# EAGLE design MainControllerBoardv2 (EAGLE 5.12)
MANUFACTURER: Vishay; MAN_PART_NO: 2N7002K-T1-E3; PRICE_1: 0.38000; PRICE_50: 0.17240; URL: http://www.digikey.com/product-detail/en/2N7002K-T1-E3/2N7002K-T1-E3CT-ND/1656760; VENDOR: Digikey
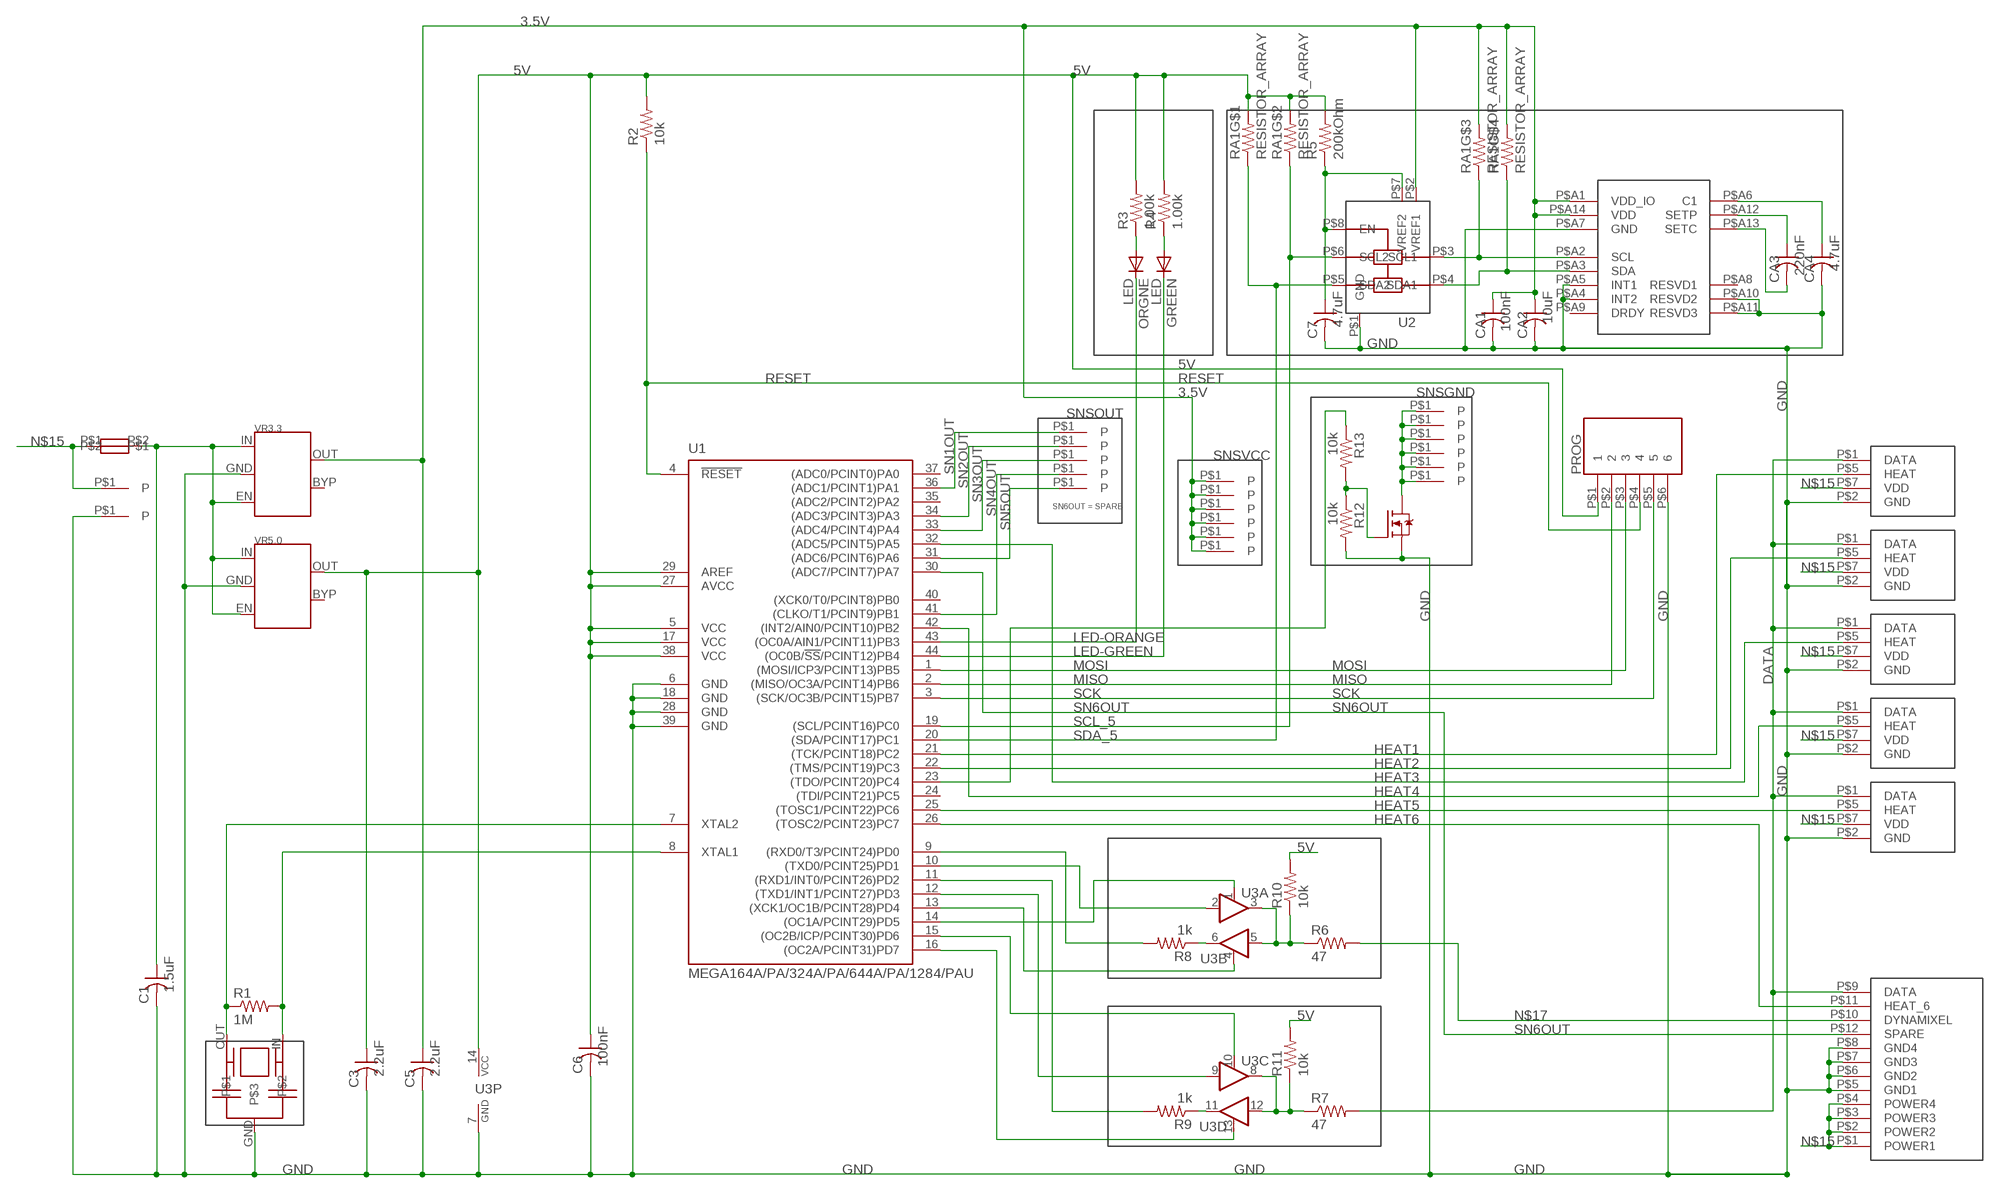
[diagram p0: schematic, sheet 1]

## Parts
BATGND  INDIVIDUAL_THROUG_HOLEDIA0.05  [INDIVIDUAL_THROUGH_HOLE_0.05]
BATVCC  INDIVIDUAL_THROUG_HOLEDIA0.05  [INDIVIDUAL_THROUGH_HOLE_0.05]
C1  1.5uF  CAPACITOR-1206  [C1206]
C3  2.2uF  CAPACITOR-1206  [C1206]
C5  2.2uF  CAPACITOR-1206  [C1206]
C6  100nF  CAPACITOR-0402  [C0402]
C7  4.7uF  CAPACITOR-0402  [C0402]
CA1  100nF  CAPACITOR-0402  [C0402]
CA2  10uF  CAPACITOR-0402  [C0402]
CA3  220nF  CAPACITOR-0402  [C0402]
CA4  4.7uF  CAPACITOR-0402  [C0402]
FFC1  FACE_BOARD_CONNECTOR  [FACE_BOARD_CONNECTOR]
FFC2  FACE_BOARD_CONNECTOR  [FACE_BOARD_CONNECTOR]
FFC3  FACE_BOARD_CONNECTOR  [FACE_BOARD_CONNECTOR]
FFC4  FACE_BOARD_CONNECTOR  [FACE_BOARD_CONNECTOR]
FFC5  FACE_BOARD_CONNECTOR  [FACE_BOARD_CONNECTOR]
FUSE  NANOFUSE  [NANOFUSE_BLOCK]
GREEN  LED  [LED0402]
ORGNE  LED  [LED0402]
PROG  CONNECTOR-FLEX(PROGRAMMING)-V2  [CONNECTOR-FLEX(PROGRAMMING)-V2]
R1  1M  RESISTOR-0402  [R0402]
R2  10k  RESISTOR-0402  [R0402]
R3  1.00k  RESISTOR-0402  [R0402]
R4  1.00k  RESISTOR-0402  [R0402]
R5  200kOhm  RESISTOR-0402  [R0402]
R6  47  RESISTOR-0402  [R0402]
R7  47  RESISTOR-0402  [R0402]
R8  1k  RESISTOR-0402  [R0402]
R9  1k  RESISTOR-0402  [R0402]
R10  10k  RESISTOR-0402  [R0402]
R11  10k  RESISTOR-0402  [R0402]
R12  10k  RESISTOR-0402  [R0402]
R13  10k  RESISTOR-0402  [R0402]
RA1  RESISTOR_ARRAY  [4XR0402]
RES  RESONATOR  [RESONATOR_CSTCE16M0V53-R0]
SENSFET  SINGLE-NFETSOT-23-3  [SOT-23-3]
SN1GND  INDIVIDUAL_THROUG_HOLEDIA0.02  [INDIVIDUAL_THROUGH_HOLE]
SN1OUT  INDIVIDUAL_THROUG_HOLEDIA0.02  [INDIVIDUAL_THROUGH_HOLE]
SN1VCC  INDIVIDUAL_THROUG_HOLEDIA0.02  [INDIVIDUAL_THROUGH_HOLE]
SN2OUT  INDIVIDUAL_THROUG_HOLEDIA0.02  [INDIVIDUAL_THROUGH_HOLE]
SN2VCC  INDIVIDUAL_THROUG_HOLEDIA0.02  [INDIVIDUAL_THROUGH_HOLE]
SN3GND  INDIVIDUAL_THROUG_HOLEDIA0.02  [INDIVIDUAL_THROUGH_HOLE]
SN3OUT  INDIVIDUAL_THROUG_HOLEDIA0.02  [INDIVIDUAL_THROUGH_HOLE]
SN3VCC  INDIVIDUAL_THROUG_HOLEDIA0.02  [INDIVIDUAL_THROUGH_HOLE]
SN4GND  INDIVIDUAL_THROUG_HOLEDIA0.02  [INDIVIDUAL_THROUGH_HOLE]
SN4OUT  INDIVIDUAL_THROUG_HOLEDIA0.02  [INDIVIDUAL_THROUGH_HOLE]
SN4VCC  INDIVIDUAL_THROUG_HOLEDIA0.02  [INDIVIDUAL_THROUGH_HOLE]
SN5GND  INDIVIDUAL_THROUG_HOLEDIA0.02  [INDIVIDUAL_THROUGH_HOLE]
SN5OUT  INDIVIDUAL_THROUG_HOLEDIA0.02  [INDIVIDUAL_THROUGH_HOLE]
SN5VCC  INDIVIDUAL_THROUG_HOLEDIA0.02  [INDIVIDUAL_THROUGH_HOLE]
SN6GND  INDIVIDUAL_THROUG_HOLEDIA0.02  [INDIVIDUAL_THROUGH_HOLE]
SN6VCC  INDIVIDUAL_THROUG_HOLEDIA0.02  [INDIVIDUAL_THROUGH_HOLE]
SNS2GND  INDIVIDUAL_THROUG_HOLEDIA0.02  [INDIVIDUAL_THROUGH_HOLE]
U1  MEGA164A/PA/324A/PA/644A/PA/1284/PAU  [TQFP44]
U2  I2C_VOLTAGE_LEVEL_TRANSLATOR  [8-VFSOP]
U3  74F126D  [SO14]
U4  ACC_MAG_LSM303DLHC  [LGA-14]
U$24  SLIPRING_CONNECTOR  [SLIPRING_CONNECTOR]
VR3.3  3.5V  POWER_REG3.3V-SOT-23-5  [SOT-23]
VR5.0  5.0V  POWER_REG5.0V-SOT-23-5  [SOT-23]

## Nets
3.5V: C5.POS CA1.POS CA2.POS RA1.P$5 RA1.P$6 SN1VCC.P$1(P) SN2VCC.P$1(P) SN3VCC.P$1(P) SN4VCC.P$1(P) SN5VCC.P$1(P) SN6VCC.P$1(P) U2.P$2(VREF1) U4.P$A1(VDD_IO) U4.P$A14(VDD) VR3.3.OUT
5V: C3.POS C6.POS PROG.P$1 R2.2 R3.2 R4.2 R5.2 R10.2 R11.2 RA1.P$7 RA1.P$8 U1.5(VCC) U1.17(VCC) U1.27(AVCC) U1.29(AREF) U1.38(VCC) U3.14(P:VCC) VR5.0.OUT
DATA: FFC1.P$1(DATA) FFC2.P$1(DATA) FFC3.P$1(DATA) FFC4.P$1(DATA) FFC5.P$1(DATA) R7.2 U$24.P$9(DATA)
GND: BATGND.P$1(P) C1.NEG C3.NEG C5.NEG C6.NEG C7.NEG CA1.NEG CA2.NEG CA4.NEG FFC1.P$2(GND) FFC2.P$2(GND) FFC3.P$2(GND) FFC4.P$2(GND) FFC5.P$2(GND) PROG.P$6 R12.2 RES.GND SENSFET.P$2(S) U1.6(GND) U1.18(GND) U1.28(GND) U1.39(GND) U2.P$1(GND) U3.7(P:GND) U4.P$A4(INT2) U4.P$A5(INT1) U4.P$A7(GND) U4.P$A10(RESVD2) U4.P$A11(RESVD3) U$24.P$5(GND1) U$24.P$6(GND2) U$24.P$7(GND3) U$24.P$8(GND4) VR3.3.GND VR5.0.GND
HEAT1: FFC1.P$5(HEAT) U1.21((TCK/PCINT18)PC2)
HEAT2: FFC2.P$5(HEAT) U1.22((TMS/PCINT19)PC3)
HEAT3: FFC3.P$5(HEAT) U1.32((ADC5/PCINT5)PA5)
HEAT4: FFC4.P$5(HEAT) U1.42((INT2/AIN0/PCINT10)PB2)
HEAT5: FFC5.P$5(HEAT) U1.25((TOSC1/PCINT22)PC6)
HEAT6: U1.26((TOSC2/PCINT23)PC7) U$24.P$11(HEAT_6)
LED-GREEN: GREEN.2(C) U1.44((OC0B/!SS!/PCINT12)PB4)
LED-ORANGE: ORGNE.2(C) U1.43((OC0A/AIN1/PCINT11)PB3)
MISO: PROG.P$2 U1.2((MISO/OC3A/PCINT14)PB6)
MOSI: PROG.P$3 U1.1((MOSI/ICP3/PCINT13)PB5)
N$2: U1.10((TXD0/PCINT25)PD1) U3.2(A:I)
N$4: U1.15((OC2B/ICP/PCINT30)PD6) U3.10(C:OE)
N$5: U1.16((OC2A/PCINT31)PD7) U3.13(D:OE)
N$7: U1.13((XCK1/OC1B/PCINT28)PD4) U3.4(B:OE)
N$8: R1.2 RES.IN U1.8(XTAL1)
N$9: R1.1 RES.OUT U1.7(XTAL2)
N$10: U1.14((OC1A/PCINT29)PD5) U3.1(A:OE)
N$12: ORGNE.1(A) R3.1
N$15: BATVCC.P$1(P) FFC1.P$7(VDD) FFC2.P$7(VDD) FFC3.P$7(VDD) FFC4.P$7(VDD) FFC5.P$7(VDD) FUSE.P$1 U$24.P$1(POWER1) U$24.P$2(POWER2) U$24.P$3(POWER3) U$24.P$4(POWER4)
N$17: R6.2 U$24.P$10(DYNAMIXEL)
N$18: R9.1 U3.11(D:O)
N$19: R7.1 R11.1 U3.8(C:O) U3.12(D:I)
N$20: R8.1 U3.6(B:O)
N$21: R6.1 R10.1 U3.3(A:O) U3.5(B:I)
N$22: R8.2 U1.9((RXD0/T3/PCINT24)PD0)
N$24: CA4.POS U4.P$A6(C1)
N$25: CA3.POS U4.P$A12(SETP)
N$26: CA3.NEG U4.P$A13(SETC)
N$29: C7.POS R5.1 U2.P$7(VREF2) U2.P$8(EN)
N$32: R12.1 R13.2 SENSFET.P$1(G)
N$33: R13.1 U1.23((TDO/PCINT20)PC4)
N$38: C1.POS FUSE.P$2 VR3.3.EN VR3.3.IN VR5.0.EN VR5.0.IN
R4: GREEN.1(A) R4.1
RESET: PROG.P$4 R2.1 U1.4(!RESET)
RXD0: R9.2 U1.11((RXD1/INT0/PCINT26)PD2)
SCK: PROG.P$5 U1.3((SCK/OC3B/PCINT15)PB7)
SCL_5: RA1.P$2 U1.19((SCL/PCINT16)PC0) U2.P$6(SCL2)
SCL_35: RA1.P$3 U2.P$3(SCL1) U4.P$A2(SCL)
SDA_5: RA1.P$1 U1.20((SDA/PCINT17)PC1) U2.P$5(SDA2)
SDA_35: RA1.P$4 U2.P$4(SDA1) U4.P$A3(SDA)
SN1OUT: SN1OUT.P$1(P) U1.36((ADC1/PCINT1)PA1)
SN2OUT: SN2OUT.P$1(P) U1.34((ADC3/PCINT3)PA3)
SN3OUT: SN3OUT.P$1(P) U1.33((ADC4/PCINT4)PA4)
SN4OUT: SN4OUT.P$1(P) U1.41((CLKO/T1/PCINT9)PB1)
SN5OUT: SN5OUT.P$1(P) U1.31((ADC6/PCINT6)PA6)
SN6OUT: U1.30((ADC7/PCINT7)PA7) U$24.P$12(SPARE)
SNSGND: SENSFET.P$3(D) SN1GND.P$1(P) SN3GND.P$1(P) SN4GND.P$1(P) SN5GND.P$1(P) SN6GND.P$1(P) SNS2GND.P$1(P)
TXD0: U1.12((TXD1/INT1/PCINT27)PD3) U3.9(C:I)
Unconnected: U1.24((TDI/PCINT21)PC5) U1.35((ADC2/PCINT2)PA2) U1.37((ADC0/PCINT0)PA0) U1.40((XCK0/T0/PCINT8)PB0) U4.P$A8(RESVD1) U4.P$A9(DRDY) VR3.3.BYP VR5.0.BYP

## Notes on the sheet
- SNSGND
- SNSOUT
- SNSVCC
- SN6OUT = SPARE

## Library data of the parts
BATGND BATVCC SN1GND SN1OUT SN1VCC SN2OUT SN2VCC SN3GND SN3OUT SN3VCC SN4GND SN4OUT SN4VCC SN5GND SN5OUT SN5VCC SN6GND SN6VCC SNS2GND = Connectors:INDIVIDUAL_THROUG_HOLE
C1 C3 C5-C7 CA1-CA4 = Passives:CAPACITOR: Capacitor
FFC1-FFC5 = Connectors:FACE_BOARD_CONNECTOR; MANUFACTURER: TE Connectivity; MAN_PART_NO: 1-84981-0; PRICE_1: 0.19000; PRICE_50: 0.13240; URL: http://search.digikey.com/us/en/products/1-84981-0/A100308CT-ND/2180637; VENDOR: Digikey
FUSE = Passives:NANOFUSE: Holder for 500mA Littlefuse fuse.; MANUFACTURER: Littlefuse; MAN_PART_NO: 0157.500DR; PRICE_1: 3.18000; PRICE_50: 2.92200; URL: http://search.digikey.com/us/en/products/0157.500DR/F2960CT-ND/1972009; VENDOR: Digikey
GREEN ORGNE = Passives:LED: Small inidicator LED
PROG = Connectors:CONNECTOR-FLEX(PROGRAMMING)-V2; MANUFACTURER: FCI; MAN_PART_NO: HFW6R-2STE1LF; PRICE_1: 0.59000; PRICE_50: 0.36900; URL: http://search.digikey.com/us/en/products/HFW6R-2STE1LF/609-1787-1-ND/1003008; VENDOR: Digikey
R1-R13 = Passives:RESISTOR: Resistor
RA1 = Passives:RESISTOR_ARRAY
RES = Passives:RESONATOR; MANUFACTURER: Murata; MAN_PART_NO: CSTCE16M0V53-R0; PRICE_1: 0.69000; PRICE_50: 0.49600; URL: http://search.digikey.com/us/en/products/CSTCE16M0V53-R0/490-1198-1-ND/584635; VENDOR: Digikey
SENSFET = Transistors:SINGLE-NFET
U1 = Devices:MEGA164A/PA/324A/PA/644A/PA/1284/P*AU: TQFP44 package of Atmega1284; MANUFACTURER: Atmel; MAN_PART_NO: ATMEGA1284-AUR; PRICE_1: 7.44000; PRICE_50: 6.22800; URL: http://search.digikey.com/us/en/products/ATMEGA1284-AUR/ATMEGA1284-AURCT-ND/2477102; VENDOR: Digikey
U2 = Devices:I2C_VOLTAGE_LEVEL_TRANSLATOR; MANUFACTURER: TI; MAN_PART_NO: PCA9306DCUR; PRICE_1: 0.94000; PRICE_50: 0.74880; URL: http://search.digikey.com/us/en/products/PCA9306DCUR/296-17988-1-ND/768360; VENDOR: Digikey
U3 = Devices:74*126: Quad bus BUFFER, 3-state; MANUFACTURER: NXP; MAN_PART_NO: N74F126D; PRICE_1: 0.46000; PRICE_50: 0.34120; URL: http://search.digikey.com/us/en/products/N74F126D,623/568-4637-1-ND/1965426; VENDOR: Digikey
U4 = Devices:ACC_MAG_LSM303DLHC: 3-axis acc/mag; MANUFACTURER: STMicroelectronics; MAN_PART_NO: LSM303DLHC; PRICE_1: 8.20000; PRICE_50: 6.71000; URL: http://search.digikey.com/us/en/products/LSM303DLHCTR/497-11918-1-ND/2757636; VENDOR: Digikey
U$24 = Connectors:SLIPRING_CONNECTOR
VR3.3 = Devices:POWER_REG: Linear Power Regulator; MANUFACTURER: Linear Technology; MAN_PART_NO: LT1761ES5-3.3; PRICE_1: 2.39000; PRICE_50: 2.13560; URL: http://search.digikey.com/us/en/products/LT1761ES5-3.3%23TRMPBF/LT1761ES5-3.3%23TRMPBFCT-ND/894314; VENDOR: Digikey
VR5.0 = Devices:POWER_REG: Linear Power Regulator; MANUFACTURER: Micrel; MAN_PART_NO: MIC5219-5.0YM5 TR; PRICE_1: 1.43000; PRICE_50: 1.14000; URL: http://search.digikey.com/us/en/products/MIC5219-5.0YM5%20TR/576-2770-1-ND/1821930; VENDOR: Digikey

## Board
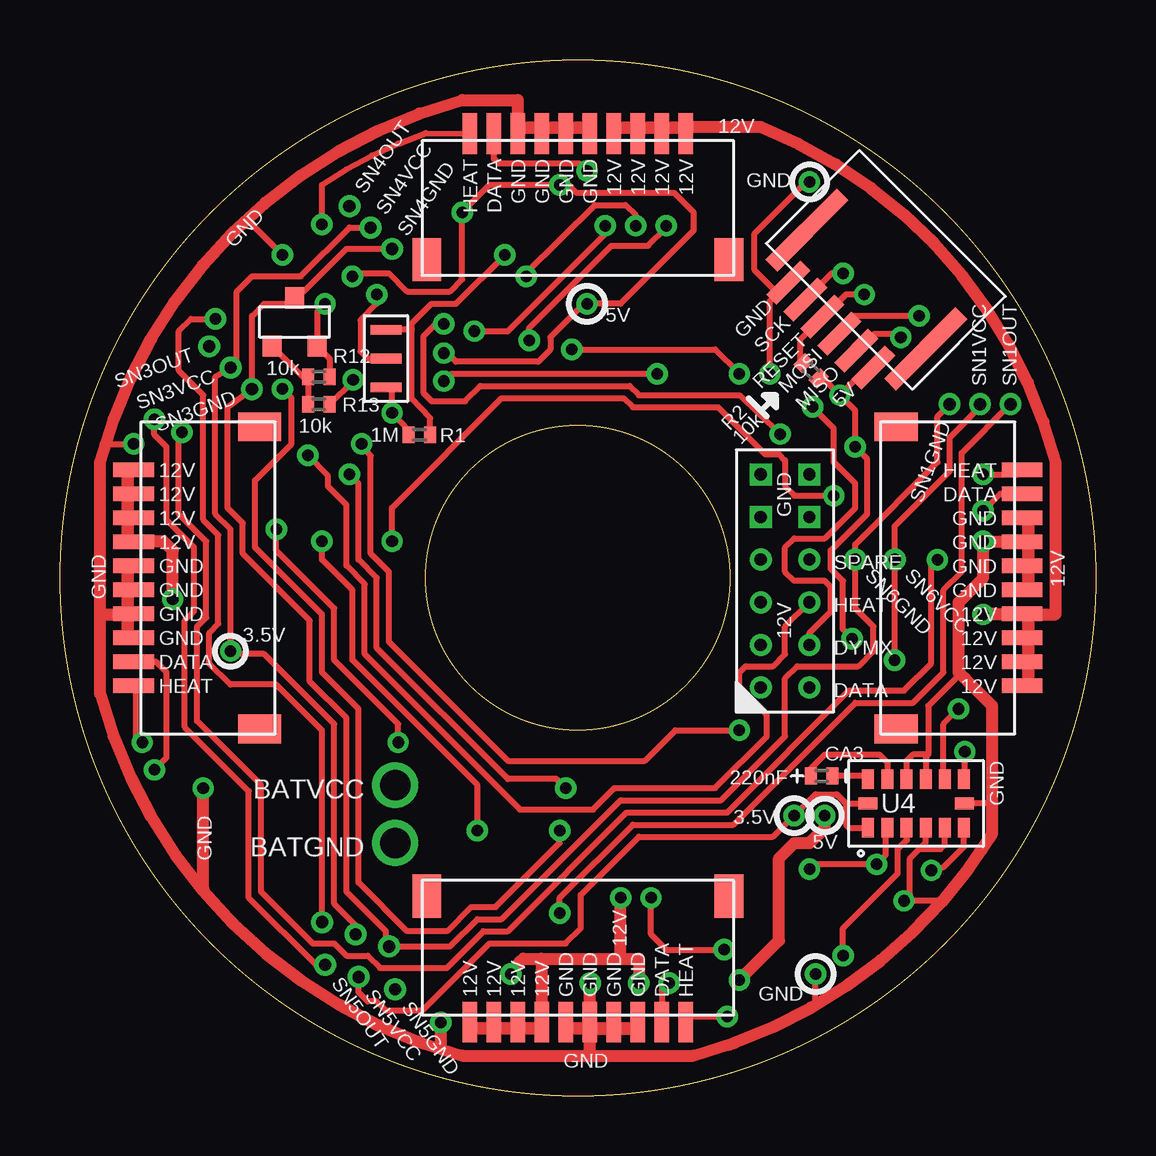
[diagram p1: board, top side]
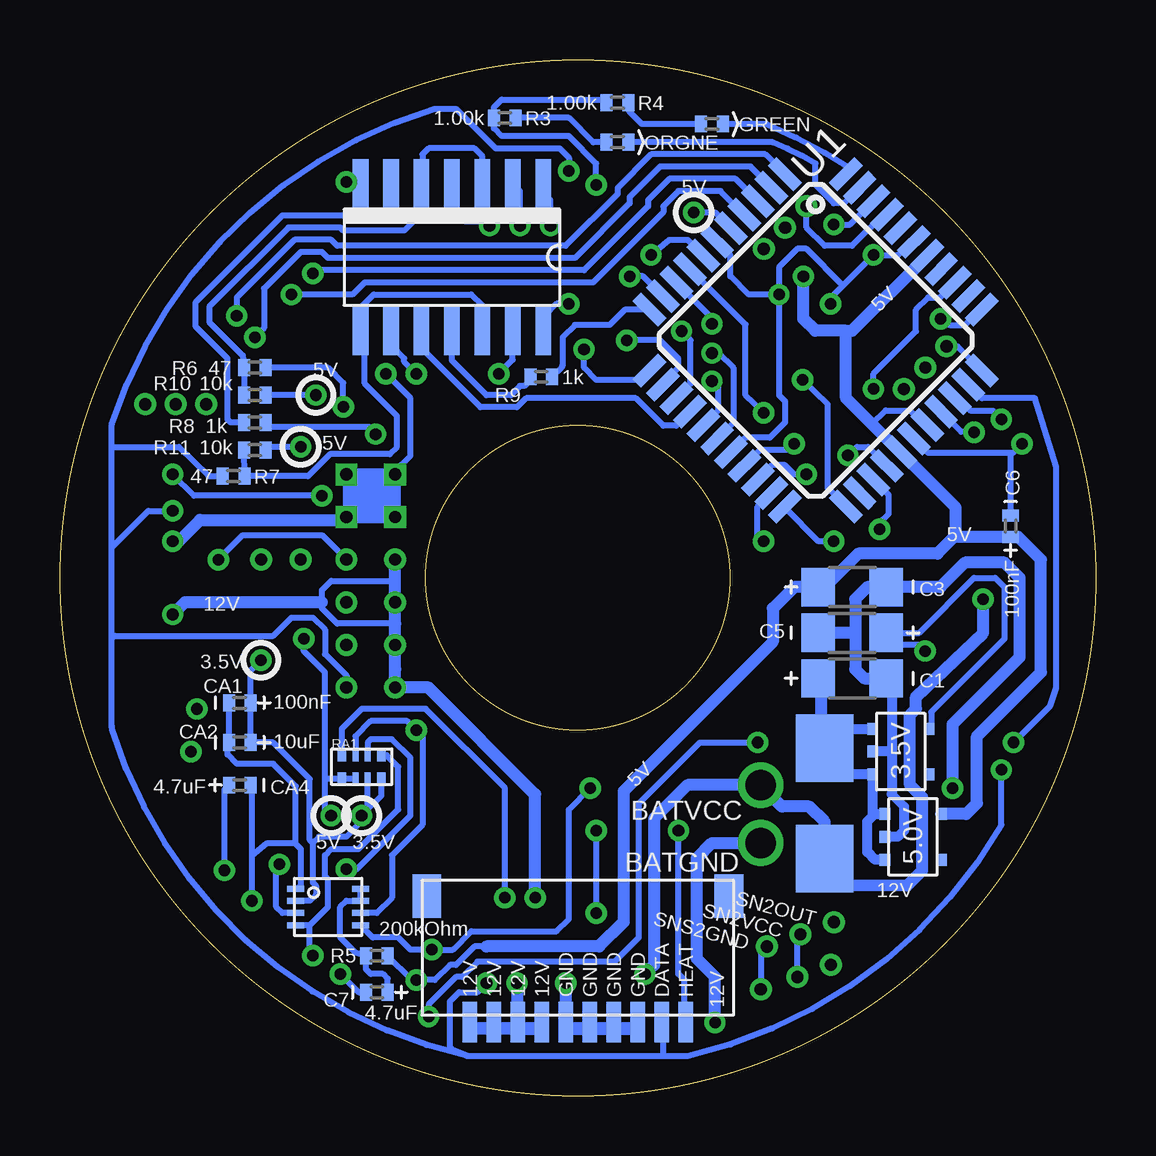
[diagram p2: board, bottom side, seen from below]

Size 43.18 x 43.18 mm. Coordinates in mm from the lower left corner, seen from the top.
Outline: circle at 21.59,21.59 radius 6.35
Outline: circle at 21.59,21.59 radius 21.59
Copper layers (1*16): Top 0.0178mm / dielectric 1.4986mm / Bottom 0.0178mm
Design rules "SSC-EAGLE-2Lyr_v1.0.0.3 *": minimum track width 10mil, minimum drill 19mil, track to track 10mil, track to pad 10mil, pad to pad 10mil, via to via 10mil, smd to smd 10mil, copper to edge 20mil, drill to drill 16mil, minimum pad ring 8mil, minimum via ring 8mil, stop-mask expansion 3mil, vias tented up to drill 0mil, thermal gap 10mil
tRestrict: area 14.2,14.2 to 29,29; area 1,1 to 42.2,42.2
bRestrict: area 1,1 to 42.2,42.2; area 14.2,14.2 to 29,29

### Footprints (pad centres in the part's own frame; a part is rotated, then mirrored left to right if it is on the bottom)
INDIVIDUAL_THROUGH_HOLE_0.05 = drill 1.27 round: P$1 0,0
C1206 = smd 1.4 x 1.6: NEG -1.422,0; POS 1.422,0
C0402 = smd 0.5 x 0.7: NEG -0.45,0; POS 0.45,0
FACE_BOARD_CONNECTOR = smd 0.6 x 1.7: P$1 -3.5,0; P$2 -2.5,0; P$3 -1.5,0; P$4 -0.5,0; P$5 -4.5,0; P$6 0.5,0; P$7 1.5,0; P$8 2.5,0; P$9 3.5,0; P$12 4.5,0 | smd 1.2 x 1.8: P$10 -6.3,-5.25; P$11 6.3,-5.25
NANOFUSE_BLOCK = smd 2.8 x 2.4: P$1 -2.3,0; P$2 2.3,0
LED0402 = smd 0.5 x 0.7: 1 -0.45,0; 2 0.45,0
CONNECTOR-FLEX(PROGRAMMING)-V2 = smd 0.6 x 2: P$1 -2.5,0; P$2 -1.5,0; P$3 -0.5,0; P$4 0.5,0; P$5 1.5,0; P$6 2.5,0 | smd 0.7 x 4.2: P$7 -3.5,-2.1; P$8 3.5,-2.1
R0402 = smd 0.5 x 0.7: 1 -0.45,0; 2 0.45,0
4XR0402 = smd 0.368 x 0.5: P$1 -0.826,0.475; P$4 0.826,0.475; P$5 0.826,-0.475; P$8 -0.826,-0.475 | smd 0.254 x 0.5: P$2 -0.254,0.475; P$3 0.254,0.475; P$6 0.254,-0.475; P$7 -0.254,-0.475
RESONATOR_CSTCE16M0V53-R0 = smd 0.4 x 1.3: GND 0,0; IN -1.2,0; OUT 1.2,0
SOT-23-3 = smd 0.787 x 0.889: P$1 0.94,1.003; P$2 -0.94,1.003; P$3 0,-1.003
INDIVIDUAL_THROUGH_HOLE = drill 0.508 round: P$1 0,0
TQFP44 = smd 1.5 x 0.5: 1 -5.8,4; 2 -5.8,3.2; 3 -5.8,2.4; 4 -5.8,1.6; 5 -5.8,0.8; 6 -5.8,0; 7 -5.8,-0.8; 8 -5.8,-1.6; 9 -5.8,-2.4; 10 -5.8,-3.2; 11 -5.8,-4; 23 5.8,-4; 24 5.8,-3.2; 25 5.8,-2.4; 26 5.8,-1.6; 27 5.8,-0.8; 28 5.8,0; 29 5.8,0.8; 30 5.8,1.6; 31 5.8,2.4; 32 5.8,3.2; 33 5.8,4 | smd 0.5 x 1.5: 12 -4,-5.8; 13 -3.2,-5.8; 14 -2.4,-5.8; 15 -1.6,-5.8; 16 -0.8,-5.8; 17 0,-5.8; 18 0.8,-5.8; 19 1.6,-5.8; 20 2.4,-5.8; 21 3.2,-5.8; 22 4,-5.8; 34 4,5.8; 35 3.2,5.8; 36 2.4,5.8; 37 1.6,5.8; 38 0.8,5.8; 39 0,5.8; 40 -0.8,5.8; 41 -1.6,5.8; 42 -2.4,5.8; 43 -3.2,5.8; 44 -4,5.8
8-VFSOP = smd 0.254 x 0.7: P$1 -0.762,-1.35; P$2 -0.254,-1.35; P$3 0.254,-1.35; P$4 0.762,-1.35; P$5 0.762,1.35; P$6 0.254,1.35; P$7 -0.254,1.35; P$8 -0.762,1.35
SO14 = smd 0.66 x 2.032: 1 -3.81,-3.073; 2 -2.54,-3.073; 3 -1.27,-3.073; 4 0,-3.073; 5 1.27,-3.073; 6 2.54,-3.073; 7 3.81,-3.073; 8 3.81,3.073; 9 2.54,3.073; 10 1.27,3.073; 11 0,3.073; 12 -1.27,3.073; 13 -2.54,3.073; 14 -3.81,3.073
LGA-14 = smd 0.5 x 0.8: P$A1 -2,-1.012; P$A2 -1.2,-1.012; P$A3 -0.4,-1.012; P$A4 0.4,-1.012; P$A5 1.2,-1.012; P$A6 2,-1.012; P$A8 2,1.012; P$A9 1.2,1.012; P$A10 0.4,1.012; P$A11 -0.4,1.012; P$A12 -1.2,1.012; P$A13 -2,1.012 | smd 0.8 x 0.5: P$A7 2.013,0; P$A14 -2.013,0
SLIPRING_CONNECTOR = drill 0.508 round: P$1 -4.572,1.016; P$2 -2.794,1.016; P$3 -1.016,1.016; P$4 0.762,1.016; P$9 -4.572,-1.016; P$10 -2.794,-1.016; P$11 -1.016,-1.016; P$12 0.762,-1.016 | drill 0.508 square: P$5 2.54,1.016; P$6 4.318,1.016; P$7 2.54,-1.016; P$8 4.318,-1.016
SOT-23 = smd 0.5 x 0.45: BYP -0.95,-1.175; EN -0.95,1.175; GND 0,1.175; IN 0.95,1.175; OUT 0.95,-1.175

### Placement (x,y rotation side)
BATGND  13.97,10.54 180 top
BATVCC  13.97,12.95 180 top
C1  10.16,17.4 180 bottom
C3  10.16,21.21 180 bottom
C5  10.16,19.3 0 bottom
C6  3.56,23.75 270 bottom
C7  29.97,4.32 0 bottom
CA1  35.69,16.38 0 bottom
CA2  35.69,14.73 0 bottom
CA3  31.75,13.34 180 top
CA4  35.69,12.95 180 bottom
FFC1  40.11,21.59 270 top
FFC2  21.59,3.07 180 bottom
FFC3  3.07,21.59 90 top
FFC4  21.59,40.11 0 top
FFC5  21.59,3.07 180 top
FUSE  11.3,12.19 90 bottom
GREEN  16,40.51 0 bottom
ORGNE  19.94,39.75 0 bottom
PROG  32.13,32.13 135 top
R1  14.99,27.56 180 top
R2  31.31,30.23 315 top
R3  24.64,40.77 180 bottom
R4  19.94,41.4 180 bottom
R5  29.97,5.84 0 bottom
R6  35.05,30.35 0 bottom
R7  35.94,25.83 180 bottom
R8  35.05,28.07 0 bottom
R9  23.11,29.97 0 bottom
R10  35.05,29.21 0 bottom
R11  35.05,26.92 0 bottom
R12  10.8,29.97 0 top
R13  10.8,28.83 180 top
RA1  30.61,13.72 0 bottom
RES  13.59,30.73 90 top
SENSFET  9.78,32.26 180 top
SN1GND  37.08,28.83 250 top
SN1OUT  39.62,28.83 90 top
SN1VCC  38.35,28.83 90 top
SN2OUT  10.92,7.24 165 bottom
SN2VCC  12.32,6.73 165 bottom
SN3GND  8,29.46 200 top
SN3OUT  6.22,31.24 200 top
SN3VCC  7.11,30.35 200 top
SN4GND  13.84,35.31 55 top
SN4OUT  12.07,37.08 55 top
SN4VCC  12.95,36.2 55 top
SN5GND  13.97,4.45 305 top
SN5OUT  11.05,5.46 305 top
SN5VCC  12.45,4.95 305 top
SN6GND  33.15,22.35 315 top
SN6VCC  34.8,22.35 315 top
SNS2GND  13.72,6.22 165 bottom
U1  11.68,31.5 315 bottom
U2  32,7.87 270 bottom
U3  26.85,34.96 180 bottom
U4  35.69,12.19 0 top
U$24  30.23,21.59 90 top
VR3.3  8.13,14.35 90 bottom
VR5.0  7.62,10.8 90 bottom

### Tracks (layer width: path | path; a pad name or v marks a point on that pad's centre or on a via)
3.5V  (via drill 0.48)
  Top 0.254: SN1VCC.P$1 38.35,28.7 37.08,27.43 37.08,26.04 34.8,23.75 SN6VCC.P$1 v34.8,18.16 | 32.77,12.19 U4.P$A14 | U4.P$A1 32.89,11.18 32.77,11.3 32.77,12.19 | 32.77,12.19 32.39,12.57 31.5,12.57 v30.61,11.68 29.72,10.8 24.13,10.8 21.72,8.38 21.72,6.99 21.08,6.35 17.91,6.35 15.11,3.56 13.59,3.56 13.21,3.94 12.83,3.94 12.45,4.32 SN5VCC.P$1 | SN4VCC.P$1 12.07,36.2 10.03,34.16 8,34.16 7.37,33.53 7.37,30.61 SN3VCC.P$1 6.48,29.97 6.48,24.26 7.11,23.62 v7.11,18.54 6.99,18.42 8.51,18.42 11.43,15.49 11.43,8 12.32,7.11 SN2VCC.P$1
  Bottom 0.254: SN5VCC.P$1 12.45,6.6 SN2VCC.P$1 | U2.P$2 32.77,8.13 32.51,8.38 32.51,8.76 32.64,8.89 32.64,10.54 | RA1.P$5 29.78,12.51 30.35,11.94 | 30.35,11.94 RA1.P$6 | 30.35,11.94 v30.61,11.68 30.61,11.43 31.24,10.8 32.39,10.8 32.64,10.54 | 32.64,10.54 32.77,10.67 32.77,13.21 34.29,14.73 CA2.POS CA1.POS 35.24,17.72 v34.8,18.16 | v7.11,18.54 7.37,18.8 8.1,18.8 C5.POS 7.37,19.3 5.08,21.59 4.19,21.59 3.81,21.21 3.81,19.05 6.86,16 6.86,15.4 VR3.3.OUT
5V  (via drill 0.48)
  Top 0.254: 34.13,30.47 34.03,30.47 PROG.P$1 33.67,30.36 v32.51,29.21 | R2.2 31.81,29.91 v32.51,29.21 | v32.51,29.21 33.15,28.57 v33.15,27.05 33.66,26.54 33.66,24.26 32.13,22.73 32.13,21.97 32.64,21.46 32.64,19.43 v33.02,19.05 | v12.19,34.16 12.32,34.29 13.72,34.29 14.48,33.53 16.26,33.53 16.76,34.04 v16.76,36.83 17.91,37.97 v20.83,37.97 21.21,37.97 21.54,37.64 25.6,37.64 26.42,36.83 26.42,36.07 23.37,33.02 v21.97,33.02 21.84,33.02 20.45,31.62 20.45,31.11 19.94,30.61 16.51,30.61 16.15,30.96 v16,30.96
  Top 0.508: v31.88,11.68 31.88,11.18 31.24,10.54 30.61,10.54 29.97,9.91 29.97,6.48 v28.32,4.83
  Bottom 0.254: U1.27 8.12,26.8 | 15.34,36.16 U1.5 15.89,36.83 v16.76,36.83 | U3.14 22.9,32.26 22.9,31.03 23.11,31.11 22.99,32.51 22.48,33.02 v21.97,33.02 | U1.29 7.09,27.96 7.11,27.94 7.76,28.57 8.76,28.57 9.34,28 | RA1.P$7 RA1.P$8 32.1,13.24 32.13,13.21 | R4.2 20.45,41.53 24.77,41.53 25.09,41.21 R3.2 25.09,40.33 24.77,40 21.97,40 20.83,38.86 v20.83,37.97 | U1.17 15.11,28.07 15.11,30.35 15.72,30.96 v16,30.96 | v32.51,29.21 R10.2 | v33.15,27.05 34.47,27.05 R11.2 | v33.02,19.05 33.02,18.54 32.13,17.65 32.13,13.21 | R5.2 28.51,4.83 v28.32,4.83 27.56,4.83 26.92,5.46 26.67,5.46 25.91,6.22 25.4,6.22 | 32.13,13.21 32.13,11.94 v31.88,11.68
  Bottom 0.508: VR5.0.OUT 5.4,11.75 4.95,12.19 4.95,14.99 2.29,17.65 2.29,22.35 3.23,23.3 C6.POS 5.84,23.3 | 5.84,23.3 5.91,23.3 6.6,22.61 9.91,22.61 11.3,21.21 C3.POS 12.57,21.21 13.46,20.32 13.46,18.92 19.69,12.7 19.69,7.24 20.7,6.22 25.4,6.22 | 8.12,26.8 5.84,24.52 5.84,23.3 | U1.27 9.34,28 10.41,29.08 10.41,31.89 | U1.38 10.16,31.89 10.41,31.89 | 10.41,31.89 11.7,31.89 12.19,32.39 v12.19,34.16
DATA  (via drill 0.48)
  Top 0.254: FFC3.P$1 4.01,18.09 4.45,17.65 4.45,14.1 v3.94,13.59 | FFC4.P$1 18.09,39.06 18.29,38.86 21.64,38.86 v21.97,38.56 | v38.48,24.38 39.19,25.09 FFC1.P$1 | FFC5.P$1 25.09,4.39 v25.4,4.7
  Bottom 0.254: v3.94,13.59 3.94,11.3 arc47 17.02,1.65 18.03,1.65 | FFC2.P$1 18.03,3.1 18.03,1.65 | 41.02,22.86 39.5,24.38 v38.48,24.38 | 18.03,1.65 26.14,1.65 26.21,1.67 | 26.21,1.67 arc60 41.01,15.28 41.02,15.42 41.02,19.05 | 41.02,22.86 41.02,27.05 | 41.02,27.05 41.02,27.99 arc55 27.56,41.15 26.67,41.15 25.02,39.5 22.35,39.5 21.97,39.12 v21.97,38.56 | R7.2 36.98,25.83 38.23,27.05 41.02,27.05 | 41.02,19.05 41.02,22.86 | U$24.P$9 31.24,17.53 32.13,18.42 32.13,19.43 32.64,19.94 33.53,19.94 34.29,19.18 40.89,19.18 arc-90 41.02,19.05 | 26.21,1.67 26.8,1.91 26.92,2.03 26.92,3.94 26.54,4.32 25.78,4.32 v25.4,4.7
GND  (via drill 0.48)
  Top 0.254: FFC3.P$2 2.79,19.34 2.79,20.07 | 5.97,8.64 arc-22 1.68,16.76 | 21.84,40.39 22.1,40.13 | 36.09,14.12 U4.P$A10 | v31.5,5.08 31.5,3.81 30.86,3.43 29.46,2.67 27.94,2.03 26.42,1.68 | U4.P$A4 36.09,10.56 35.81,10.29 | U4.P$A5 36.89,10.47 36.7,10.29 35.81,10.29 | 35.81,10.29 35.43,9.91 35.43,8.38 v35.18,8.13 36.83,8.13 | 36.83,8.13 arc-12 37.72,9.14 | U4.P$A11 35.29,13.95 35.56,14.22 36.11,14.22 36.09,14.12 | 9.14,5.59 11.81,3.68 14.25,2.46 | 14.25,2.46 14.61,2.29 15.69,2.03 | 16.76,1.68 15.69,2.03 | 29.86,33.4 29.59,33.13 v29.59,30.1 | 29.86,33.4 PROG.P$6 | 29.86,33.4 29.72,33.66 28.96,34.42 28.96,35.94 31.11,38.1 v31.24,38.1 | U4.P$A7 38.73,12.19 arc-90 38.86,12.07 | 14.25,2.46 14.22,2.49 | 8.51,37.21 8.64,37.21 | 8.51,37.21 11.81,39.5 13.97,40.64 16.76,41.5 | 38.86,10.92 38.55,10.35 38.55,10.22 36.83,8.13 | v3.07,27.18 1.78,27.18 1.68,26.42 | 8.51,37.21 7.75,36.58 v9.27,35.05 | RES.GND 12.83,30.73 12.52,31.04 12.52,32.33 13.21,33.02 v13.21,33.4 | v11.05,33.02 10.72,32.69 SENSFET.P$2 11.25,30.73 R12.2 | 15.69,2.03 15.88,2.03 | 36.09,14.12 36.2,14.22 36.2,16.26 37.47,17.53 37.72,17.4
  Top 0.508: 22.1,1.68 16.76,1.68 arc-60 1.68,16.76 1.68,20.07 | 22.1,1.68 26.42,1.68 arc43 38.86,10.92 38.86,12.07 38.86,16.26 37.72,17.4 37.47,17.65 37.47,20.57 38.48,21.59 v38.48,23.11 40.39,23.11 40.39,24.09 FFC1.P$2 | FFC5.P$2 24.09,2.79 22.1,2.79 | 22.1,1.68 22.1,2.79 | 22.1,40.39 21.84,40.39 19.09,40.39 FFC4.P$2 19.08,40.82 19.08,41.5 16.76,41.5 arc60 1.68,26.42 1.68,20.07 | 1.68,20.07 2.79,20.07 | 22.1,2.79 v22.1,4.7 | 5.97,8.64 v5.97,12.83 | 15.88,2.03 v15.88,3.05
  Bottom 0.254: U1.18 14.62,27.43 13.59,27.43 12.95,28.07 12.95,28.96 13.21,29.21 v13.21,33.4 | 30.84,37.72 arc-90 U3.7 31.17,38.03 v31.24,38.1 | 35.18,10.03 34.54,10.54 33.4,10.54 33.35,10.49 | v35.18,8.13 35.18,10.03 | CA1.NEG CA2.NEG 36.2,14.67 36.2,14.22 35.81,13.84 34.29,13.84 33.35,12.91 33.35,10.49 | C7.NEG 30.73,4.32 v31.5,5.08 | 33.35,10.49 33.15,10.29 33.15,8.72 U2.P$1 | 35.18,10.03 35.18,12.9 CA4.NEG | 29.34,25.91 U$24.P$6 29.21,26.04 28.57,26.67 28.57,29.08 v29.59,30.1 | v9.27,35.05 8.26,35.05 7.71,35.6 U1.39 | U1.6 15.24,35.05 15.24,34.16 14.48,33.4 v13.21,33.4 | v9.27,35.05 9.4,34.92 | U1.28 6.99,26.8 3.56,26.8 | 3.56,26.8 3.45,26.8 v3.07,27.18 | 3.56,26.8 C6.NEG | v9.27,35.05 10.54,33.78 | 10.54,33.78 11.05,33.27 v11.05,33.02 11.18,33.15 | v13.21,33.4 13.21,34.54 12.45,35.31 12.07,35.31 10.54,33.78
  Bottom 0.381: 8.51,12.57 8,12.07
  Bottom 0.406: 8.51,14.35 VR3.3.GND | VR5.0.GND 8.26,10.8 8,11.05 8,12.07 | 8.51,14.35 8.51,12.57 | 8.51,14.35 8.51,17.04 C1.NEG
  Bottom 0.508: FFC2.P$2 19.09,2.79 22.1,2.79 v22.1,4.7 | U$24.P$8 U$24.P$6 U$24.P$5 U$24.P$7 31.37,24 37.34,24 38.23,23.11 v38.48,23.11 | 10.03,19.3 10.03,20.7 9.53,21.21 C3.NEG 6.48,21.21 5.46,22.23 3.81,22.23 3.18,21.59 3.18,18.29 5.97,15.49 v5.97,12.83 | 10.03,19.3 10.03,17.78 9.65,17.4 C1.NEG | 10.03,19.3 C5.NEG | BATGND.P$1 16,10.54 16.64,9.91 16.64,5.72 15.88,4.95 v15.88,3.05
HEAT1  (via drill 0.48)
  Top 0.254: v13.84,23.11 13.84,24.51 18.42,29.08 23.5,29.08 23.88,28.7 27.43,28.7 29.39,26.75 29.97,26.75 30.23,26.49 30.23,25.4 30.61,25.02 v32.26,25.02 | FFC1.P$5 39.95,25.91 v38.48,25.91
  Bottom 0.254: U1.21 14.1,24.56 14.1,23.37 v13.84,23.11 | v38.48,25.91 37.59,25.02 v32.26,25.02
HEAT2  (via drill 0.48)
  Top 0.254: v10.92,23.11 10.92,22.35 12.19,21.08 12.19,18.16 17.4,12.95 v17.4,11.05
  Bottom 0.254: FFC2.P$5 17.09,3.18 17.14,3.18 17.14,4.83 17.4,5.08 v17.4,11.05 | U1.22 12.96,24.51 11.56,23.11 v10.92,23.11
HEAT3  (via drill 0.48)
  Top 0.254: v3.43,14.73 3.18,14.99 3.18,17.09 FFC3.P$5
  Bottom 0.254: v3.43,14.73 1.91,16.26 1.65,16.99 1.65,26.21 2.54,29.08 4.75,29.08 U1.32
HEAT4  (via drill 0.48)
  Top 0.254: 17.09,40.2 FFC4.P$5 15.24,40.13 arc15 10.92,37.97 v10.92,36.32
  Bottom 0.254: U1.42 10.25,36.32 v10.92,36.32
HEAT5  (via drill 0.48)
  Top 0.254: FFC5.P$5 26.09,3.3 v27.81,3.3 | v9.02,23.62 9.02,22.73 11.43,20.32 11.43,18.16 14.1,15.49 v14.1,14.73
  Bottom 0.254: v27.81,3.3 27.81,3.81 26.67,4.95 26.42,4.95 25.78,5.59 20.07,5.59 19.05,6.6 19.05,12.19 16.51,14.73 v14.1,14.73 | U1.25 8.64,25.05 8.64,24.26 9.02,23.88 v9.02,23.62
HEAT6  (via drill 0.48)
  Top 0.254: v10.34,26.7 11.18,25.83 11.18,25.4 11.94,24.64 11.94,22.1 12.7,21.34 12.7,18.42 19.18,11.94 22.23,11.94 23.11,12.83 27.3,12.83 29.46,14.99 29.46,15.88 29.21,16.13 28.7,16.13 28.32,16.51 28.32,17.65 28.57,17.91 29.72,17.91 30.23,18.42 30.23,19.56 U$24.P$11
  Bottom 0.254: U1.26 9.5,27.05 9.96,27.05 v10.34,26.7
LED-GREEN
  Bottom 0.254: GREEN.2 13.72,40.51 arc10 10.16,38.61 U1.44
LED-ORANGE
  Bottom 0.254: U1.43 10.5,37.21 10.92,37.21 11.68,37.97 11.68,38.86 arc-10 13.46,39.75 ORGNE.2
MISO  (via drill 0.48)
  Top 0.254: PROG.P$2 33.23,31.07 33.91,31.75 34.92,31.75 v35.05,31.62
  Bottom 0.254: U1.2 14.4,38.73 18.16,38.73 19.43,37.47 19.43,37.21 21.72,34.92 32,34.92 32.26,35.18 33.15,35.18 34.67,33.66 34.67,32 v35.05,31.62
MOSI  (via drill 0.48)
  Top 0.254: PROG.P$3 32.54,31.78 33.02,32.51 v35.81,32.51
  Bottom 0.254: U1.1 13.77,39.24 18.54,39.24 19.94,37.85 19.94,37.59 22.1,35.43 31.62,35.43 31.88,35.69 33.4,35.69 35.81,33.27 v35.81,32.51
N$2  (via drill 0.48)
  Top 0.254: v24,36.27 24,36.7 23.57,37.14 22.3,37.14 19.43,34.29 v19.43,34.16
  Bottom 0.254: 19.05,34.16 v19.43,34.16 18.88,34.16 U1.10 | U3.2 24,37.73 v24,36.27
N$4
  Bottom 0.254: U1.15 17.5,27.94 18.03,27.94 19.18,29.08 23.75,29.08 24.13,28.7 25.65,28.7 28.12,31.16 U3.10 27.99,32.05 28.07,31.97 28.32,31.5
N$5  (via drill 0.48)
  Top 0.254: v24.89,30.1 16.31,30.1 v16,29.79
  Bottom 0.254: U1.16 15.74,28.57 15.74,29.53 v16,29.79 | v24.89,30.1 24.3,30.69 U3.13
N$7  (via drill 0.48)
  Top 0.254: v25.27,36.27 25.27,36.2 24.51,35.43 22.99,35.43 19.56,32 v19.56,31.5
  Bottom 0.254: U3.4 26.85,37 26.29,36.45 25.53,36.45 v25.27,36.27 | v19.56,31.5 18.16,31.5 17.4,30.73 17.4,30.35 18.05,29.7 U1.13
N$8  (via drill 0.48)
  Top 0.254: R1.2 14.54,27.76 v13.84,28.47 13.84,29.53 RES.IN
  Bottom 0.254: U1.8 14.61,32.15 14.61,29.21 v13.84,28.47
N$9  (via drill 0.48)
  Top 0.254: 18.67,35.05 v18.54,35.05 16.51,33.02 15.49,33.02 14.66,32.18 14.66,32.03 | 14.66,32.03 14.66,29.06 15.44,28.25 R1.1 | RES.OUT 14.66,31.93 14.66,32.03
  Bottom 0.254: v18.54,35.05 17.78,35.69 17.02,35.69 16.36,35.03 U1.7
N$10  (via drill 0.48)
  Top 0.254: v17.27,31.88 18.67,31.88 22.73,35.94 v22.73,36.27
  Bottom 0.254: 22.91,38.15 U3.1 23.04,38.69 23.11,37.72 22.73,37.34 v22.73,36.27 | U1.14 16.89,29.68 16.89,31.5 v17.27,31.88
N$12
  Bottom 0.254: ORGNE.1 20.96,39.75 21.97,40.77 R3.1
N$14  (via drill 0.48)
  Top 0.254: 36.83,13.21 36.83,15.49 v37.47,16.13
N$15  (via drill 0.48)
  Top 0.254: FFC3.P$7 2.92,23.22 3.05,23.11 | FFC5.P$7 20.09,2.79 20.07,2.79 | FFC1.P$7 40.39,19.84 40.39,20.07 | 26.04,40.39 23.34,40.39 arc90 FFC4.P$7
  Top 0.508: 3.05,23.11 4.32,23.11 4.7,22.73 v4.7,20.7 | 20.07,5.72 20.07,2.79 | 20.07,5.72 23.37,5.72 | v18.8,5.08 19.18,5.59 19.3,5.72 20.07,5.72 | v24.13,4.7 24.13,5.72 23.37,5.72 | 26.04,40.39 29.21,40.39 arc-54 41.5,26.42 41.5,20.07 40.39,20.07 | v38.48,20.07 38.89,20.09 FFC1.P$7 | 23.37,5.72 v23.37,8.26
  Bottom 0.254: 29.34,21.46 31.88,21.46 32.26,21.08 32.26,20.57 32.26,20.32 31.62,19.69 29.21,19.69 | 29.21,17.78 29.34,17.91
  Bottom 0.508: FFC2.P$7 23.09,2.79 24.13,2.79 v24.13,4.7 | U$24.P$4 U$24.P$3 29.21,19.69 U$24.P$2 29.21,17.78 U$24.P$1 27.81,17.02 23.37,12.57 v23.37,8.26 | FUSE.P$1 11.04,9.78 | 32.26,20.57 37.97,20.57 v38.48,20.07 | FUSE.P$1 11.43,8.89 11.81,9.79 11.43,8.77 7.87,8.76 7.24,9.4 7.24,12.45 7.75,12.95 7.75,15.88 7.49,16.13 7.49,16.64 4.7,19.3 v4.7,20.7 | v18.8,5.08 18.42,5.46 18.42,11.56 17.02,12.95 BATVCC.P$1 13.08,12.07 11.95,12.07 11.3,11.42 FUSE.P$1
N$16  (via drill 0.48)
  Top 0.254: 37.72,13.21 v37.72,14.35
N$17  (via drill 0.48)
  Top 0.254: v31.37,28.73 31.6,28.47 32.26,27.81 32.26,26.42 33.15,25.53 33.15,24.51 31.88,23.24 30.61,23.24 30.23,22.86 30.23,21.84 30.61,21.46 31.88,21.46 32.13,21.21 32.13,20.19 31.24,19.3 U$24.P$10
  Bottom 0.254: R6.2 32,30.35 31.37,29.72 v31.37,28.73
N$18
  Bottom 0.254: 27.04,31.88 26.92,31.75 26.85,31.83 U3.11 26.85,30.66 25.4,29.21 24.38,29.21 24,29.59 23.82,29.59 23.56,29.85 R9.1
N$19
  Bottom 0.254: U3.12 25.58,32.94 26.04,33.4 30.1,33.4 30.61,32.89 30.61,32.57 U3.8 | U3.8 30.78,32 | U3.8 30.66,31.24 30.48,31.07 30.48,29.69 29.13,28.35 29.13,27.05 29.44,26.75 31.93,26.75 32.84,25.83 R7.1 R11.1
N$20
  Bottom 0.254: U3.6 29.39,36.91 29.72,36.58 31.11,36.58 31.24,36.7 33.91,36.7 37.52,33.09 37.52,32.06 36.2,30.73 36.2,28.19 36.07,28.07 R8.1
N$21
  Bottom 0.254: U3.3 25.58,39.16 25.91,39.5 27.81,39.5 28.07,39.24 28.07,38.71 U3.5 28.12,36.78 28.83,36.07 31.37,36.07 31.5,36.2 33.66,36.2 36.96,32.89 36.96,32.26 35.56,30.86 R6.1 R10.1
N$22  (via drill 0.48)
  Top 0.254: v30.02,27.58 29.13,28.42 28.32,29.21 24.13,29.21 23.75,29.59 17.53,29.59 16.89,28.96 15.49,28.96 15.16,29.29 15.16,31.67 15.67,32.18 v16,32.18
  Bottom 0.254: R8.2 34.42,27.88 30.28,27.88 v30.02,27.58 | U1.9 16,32.42 v16,32.18
N$24  (via drill 0.48)
  Top 0.254: U4.P$A6 37.69,10.38 36.83,9.53 36.32,9.53 v36.32,9.4
  Bottom 0.254: CA4.POS 36.32,12.76 v36.32,9.4
N$25
  Top 0.254: U4.P$A12 34.49,13.9 34.16,14.22 31.88,14.22 31.3,13.65 CA3.POS
N$26
  Top 0.254: U4.P$A13 33.69,13.3 | U4.P$A13 33.62,13.27 | CA3.NEG 33.56,13.34 U4.P$A13
N$29
  Bottom 0.254: U2.P$8 U2.P$7 31.24,8.13 31.5,7.87 31.5,6.6 30.86,5.97 R5.1 30.42,5.28 30.23,5.08 29.72,5.08 29.52,4.88 C7.POS
N$32
  Top 0.254: R13.2 R12.1 10.35,29.75 SENSFET.P$1
N$33  (via drill 0.48)
  Top 0.254: R13.1 12.22,29.8 v12.22,29.85
  Bottom 0.254: U1.23 11.18,25.33 11.18,28.83 v12.22,29.85
N$38
  Bottom 0.254: FUSE.P$2 11.61,15.3 | 10.8,13.4 11.24,13.4 11.43,13.59
  Bottom 0.381: 8.89,11.75 VR5.0.IN
  Bottom 0.406: 11.43,13.59 11.5,13.9 | 11.61,15.3 VR3.3.IN | FUSE.P$2 10.8,13.4 VR3.3.EN 9.3,11.75 9.21,11.75 | VR5.0.EN 9.21,9.85 9.53,10.16 9.53,11.43 9.21,11.75 | 9.21,11.75 8.89,11.75
  Bottom 0.508: C1.POS 11.43,17.5 11.43,14.61 11.16,14.34 FUSE.P$2
R4
  Bottom 0.254: GREEN.1 18.92,40.51 19.43,41.02 R4.1
RESET  (via drill 0.48)
  Top 0.254: R2.1 30.84,30.44 30.84,31.52 31.9,32.54 | 31.9,32.54 PROG.P$4 | 31.9,32.54 32.77,33.4 v33.53,33.4
  Bottom 0.254: U1.4 15.64,37.72 17.4,37.72 18.03,37.08 18.03,36.83 20.96,33.91 30.48,33.91 30.99,33.4 v33.53,33.4
RXD0
  Bottom 0.254: R9.2 22.28,30.35 22.23,30.48 22.23,31.62 21.72,32.13 20.27,32.13 19.63,32.77 U1.11
SCK  (via drill 0.48)
  Top 0.254: PROG.P$5 32.17,34.29 v32.64,34.29
  Bottom 0.254: 14.05,37.29 U1.3 15.02,38.23 17.78,38.23 18.67,37.34 18.67,37.08 21.34,34.42 32.26,34.42 32.39,34.29 v32.64,34.29
SCL_5  (via drill 0.48)
  Top 0.254: v12.57,27.18 12.95,26.67 12.95,22.61 13.72,21.84 13.72,18.92 18.67,13.97 24.38,13.97 25.65,15.24 v28.32,15.24
  Bottom 0.254: U1.19 13.99,26.92 12.7,26.92 v12.57,27.18 | RA1.P$2 30.86,14.99 30.23,15.62 28.7,15.62 v28.32,15.24 28.07,14.99 28.07,11.3 29.34,10.03 29.34,8.26 29.97,7.62 U2.P$6
SCL_35  (via drill 0.48)
  Top 0.254: U4.P$A2 34.42,11.05 34.42,10.03 v34.04,9.65 31.45,9.65 v31.24,9.45
  Bottom 0.254: RA1.P$3 30.35,14.73 30.23,14.86 29.34,14.86 28.57,14.1 28.57,11.68 30.81,9.45 v31.24,9.45 | v34.04,9.65 34.16,9.53 34.16,7.87 33.91,7.62 U2.P$3
SDA_5  (via drill 0.48)
  Top 0.254: v12.07,25.91 12.45,25.53 12.45,22.35 13.21,21.59 13.21,18.67 18.67,13.21 20.7,13.21 v21.08,12.83 | v24.64,8.26 24.64,6.73 25.27,6.1 v27.69,6.1
  Bottom 0.254: U1.20 13.5,26.29 12.95,26.29 12.57,25.91 v12.07,25.91 | RA1.P$1 31.43,15.3 30.61,16.13 27.94,16.13 24.64,12.83 v24.64,8.26 | v21.08,12.83 21.97,11.94 21.97,7.37 22.48,6.86 26.04,6.86 26.8,6.1 v27.69,6.1 28.57,6.1 29.08,6.6 30.15,6.6 U2.P$5
SDA_35  (via drill 0.48)
  Top 0.254: U4.P$A3 35.31,11.16 35.31,10.67 34.92,10.29 34.92,9.27 32.64,6.99 v32.64,5.84
  Bottom 0.254: RA1.P$4 29.56,14.19 29.08,13.72 29.08,11.94 30.73,10.29 31.88,10.29 32.13,10.03 32.13,9.14 32,9.02 32,7.87 32.77,7.11 | 32.77,7.11 U2.P$4 | v32.64,5.84 32.77,5.97 32.77,7.11
SN1OUT  (via drill 0.48)
  Top 0.254: SN1OUT.P$1 37.59,26.8 37.59,21.84 36.83,21.08 36.83,17.65 35.56,16.38 33.15,16.38 28.07,11.3 23.88,11.3 20.83,8.26 v20.83,7.62 | v9.27,29.46 9.65,29.08 9.65,27.18 8.13,25.65 8.13,22.86 10.92,20.07 10.92,17.65 12.45,16.13 12.45,8.89 14.48,6.86 16.13,6.86 17.14,7.87 18.16,7.87 20.83,10.54 v20.83,11.05
  Bottom 0.254: U1.36 6.51,33.27 6.99,33.27 7.49,32.77 7.49,31.88 9.27,30.1 v9.27,29.46 | v20.83,11.05 v20.83,7.62
SN2OUT  (via drill 0.48)
  Top 0.254: SN2OUT.P$1 10.92,15.24 9.02,17.14 7.11,17.14 6.22,18.03 6.22,19.3 6.6,19.69 6.6,23.37 5.97,24 5.97,29.21 4.95,30.23 4.95,31.88 5.46,32.39 v6.48,32.39
  Bottom 0.254: U1.34 5.14,32.39 5.21,32.39 5.46,32.13 6.1,32.13 v6.48,32.39
SN3OUT
  Bottom 0.254: U1.33 5.77,31.24 SN3OUT.P$1
SN4OUT
  Bottom 0.254: SN4OUT.P$1 12.07,36.2 11.3,35.43 10.16,35.43 8.87,36.73 U1.41
SN5OUT  (via drill 0.48)
  Top 0.254: SN5OUT.P$1 10.67,5.46 7.87,8.26 7.87,12.7 5.21,15.37 5.21,19.81 5.59,20.19 5.59,22.86 4.45,24 4.45,27.05 3.94,27.56 v3.94,28.19
  Bottom 0.254: U1.31 5.21,28.55 4.29,28.55 v3.94,28.19
SN6OUT  (via drill 0.48)
  Top 0.254: v36.58,22.35 36.32,22.1 36.32,18.03 35.18,16.89 32.89,16.89 27.81,11.81 23.62,11.81 18.67,6.86 17.65,6.86 16.13,5.33 13.34,5.33 12.83,5.84 11.94,5.84 11.43,6.35 10.54,6.35 8.38,8.51 8.38,12.95 5.72,15.62 5.72,19.56 6.1,19.94 6.1,23.11 4.95,24.26 4.95,27.56 v5.08,27.66
  Bottom 0.254: U$24.P$12 32.26,23.37 35.56,23.37 v36.58,22.35 | U1.30 5.61,27.69 v5.08,27.66
SNSGND
  Top 0.254: SN1GND.P$1 36.58,28.32 36.58,26.42 33.15,22.99 SN6GND.P$1 33.15,20.32 33.91,19.56 33.91,18.54 33.27,17.91 30.73,17.91 30.23,17.4 30.23,14.99 27.56,12.32 23.37,12.32 18.42,7.37 17.4,7.37 16.26,6.22 SNS2GND.P$1 13.97,6.22 13.59,6.6 13.59,6.86 11.94,8.51 11.94,15.75 10.41,17.27 10.41,19.81 7.62,22.61 7.62,23.88 6.99,24.51 6.99,28.7 SN3GND.P$1 8,32.51 8.51,33.02 9.41,33.02 SENSFET.P$3 9.65,33.53 10.16,33.53 11.94,35.31 SN4GND.P$1
  Bottom 0.254: SN5GND.P$1 13.97,5.97 SNS2GND.P$1
TXD0  (via drill 0.48)
  Top 0.254: v21.34,31.11 27.3,31.11 v28.32,30.1
  Bottom 0.254: 18.55,30.22 U1.12 19.05,29.84 19.05,29.85 20.83,29.85 21.34,30.35 v21.34,31.11 | U3.9 29.39,31.29 28.83,30.73 28.83,30.61 v28.32,30.1
(copper drawn outside any net)
  shapes: Bottom area x1

### Text on the board
tNames: 12V | GND | GND | 5V | 12V | GND | 3.5V | GND | 3.5V | GND | 5V | 12V | GND | GND
bNames: 5V | 5V | 5V | 5V | 5V | 12V | 3.5V | 5V | 3.5V | 5V | 12V | 12V